# EAGLE design Rx1.0 (EAGLE 7.6.0)
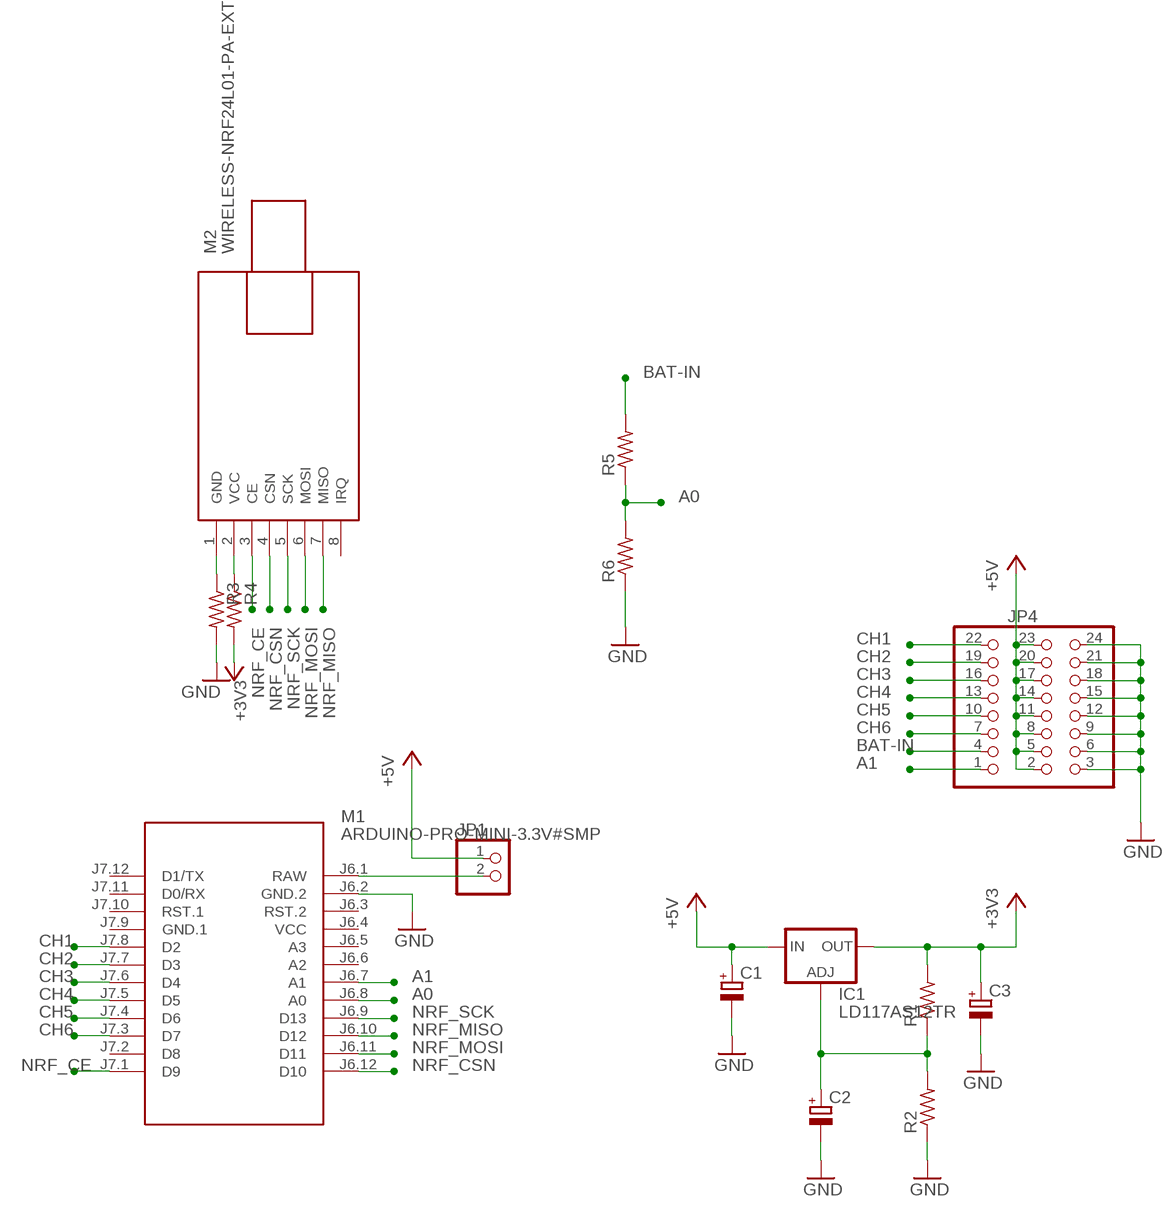
[diagram p0: schematic, sheet 1]

## Parts
C1  CPOL-EUE1.8-4  [E1,8-4]
C2  CPOL-EUE1.8-4  [E1,8-4]
C3  CPOL-EUE1.8-4  [E1,8-4]
IC1  LD117AS12TR  [SOT223]
JP1  PINHD-1X2  [1X02]
JP4  PINHD-3X8  [2X08]
M1  ARDUINO-PRO-MINI-3.3V#SMP  [ARDUINO-PRO-MINI#SMP]
M2  WIRELESS-NRF24L01-PA-EXT  [WIRELESS-NRF24L01-PA-EXT]
R1  R-US_0204/2V  [0204V]
R2  R-US_0204/2V  [0204V]
R3  R-US_0204/2V  [0204V]
R4  R-US_0204/2V  [0204V]
R5  R-US_0204/2V  [0204V]
R6  R-US_0204/2V  [0204V]

## Nets
+3V3: C3.+ IC1.4(OUT) R1.2 R4.2
+5V: C1.+ IC1.3(IN) JP1.1 JP4.2 JP4.5 JP4.8 JP4.11 JP4.14 JP4.17 JP4.20 JP4.23
A0: M1.J6.8(A0) R5.1 R6.2
A1: JP4.1 M1.J6.7(A1)
BAT-IN: JP4.4 R5.2
CH1: JP4.22 M1.J7.8(D2)
CH2: JP4.19 M1.J7.7(D3)
CH3: JP4.16 M1.J7.6(D4)
CH4: JP4.13 M1.J7.5(D5)
CH5: JP4.10 M1.J7.4(D6)
CH6: JP4.7 M1.J7.3(D7)
GND: C1.- C2.- C3.- JP4.3 JP4.6 JP4.9 JP4.12 JP4.15 JP4.18 JP4.21 JP4.24 M1.J6.2(GND.2) R2.1 R3.2 R6.1
N$1: M2.1(GND) R3.1
N$2: M2.2(VCC) R4.1
N$5: C2.+ IC1.1(ADJ) R1.1 R2.2
N$54: JP1.2 M1.J6.1(RAW)
NRF_CE: M1.J7.1(D9) M2.3(CE)
NRF_CSN: M1.J6.12(D10) M2.4(CSN)
NRF_MISO: M1.J6.10(D12) M2.7(MISO)
NRF_MOSI: M1.J6.11(D11) M2.6(MOSI)
NRF_SCK: M1.J6.9(D13) M2.5(SCK)
Unconnected: M1.J6.3(RST.2) M1.J6.5(A3) M1.J6.6(A2) M1.J7.2(D8) M1.J7.10(RST.1) M1.J7.11(D0/RX) M1.J7.12(D1/TX) M2.8(IRQ)

## Power pins joined to a net without a drawn wire
GND.1: M1.J7.9(GND.1)
VCC: M1.J6.4(VCC)

## Library data of the parts
C1-C3 = rcl:CPOL-EU: POLARIZED CAPACITOR, European symbol
IC1 = v-reg:LD117A?*: Low drop fixed and adjustable positive voltage regulators 1 A Source: http://www.st.com/stonline/products/literature/ds/7194/ld1117axx.pdf
JP1 = pinhead:PINHD-1X2: PIN HEADER
JP4 = pinhead_2:PINHD-3X8: PIN HEADER
M1 = diy-modules:ARDUINO-PRO-MINI-*#SMP: Arduino Pro Mini (and compatible devices) with 2 connectors only More details available here: https://www.arduino.cc/en/Main/ArduinoBoardProMini Click here to find device on ebay.com <http://www.ebay.com/sch/arduino+pro+mini>
M2 = diy-modules:WIRELESS-NRF24L01-PA-EXT: 2.4 GHz Wireless Module based on NRF24L01 chip with preamplifier and external antenna Click here to find device on ebay.com <http://www.ebay.com/sch/nrf24l01+pa+lna+sma>
R1-R6 = rcl:R-US_: RESISTOR, American symbol

## Board
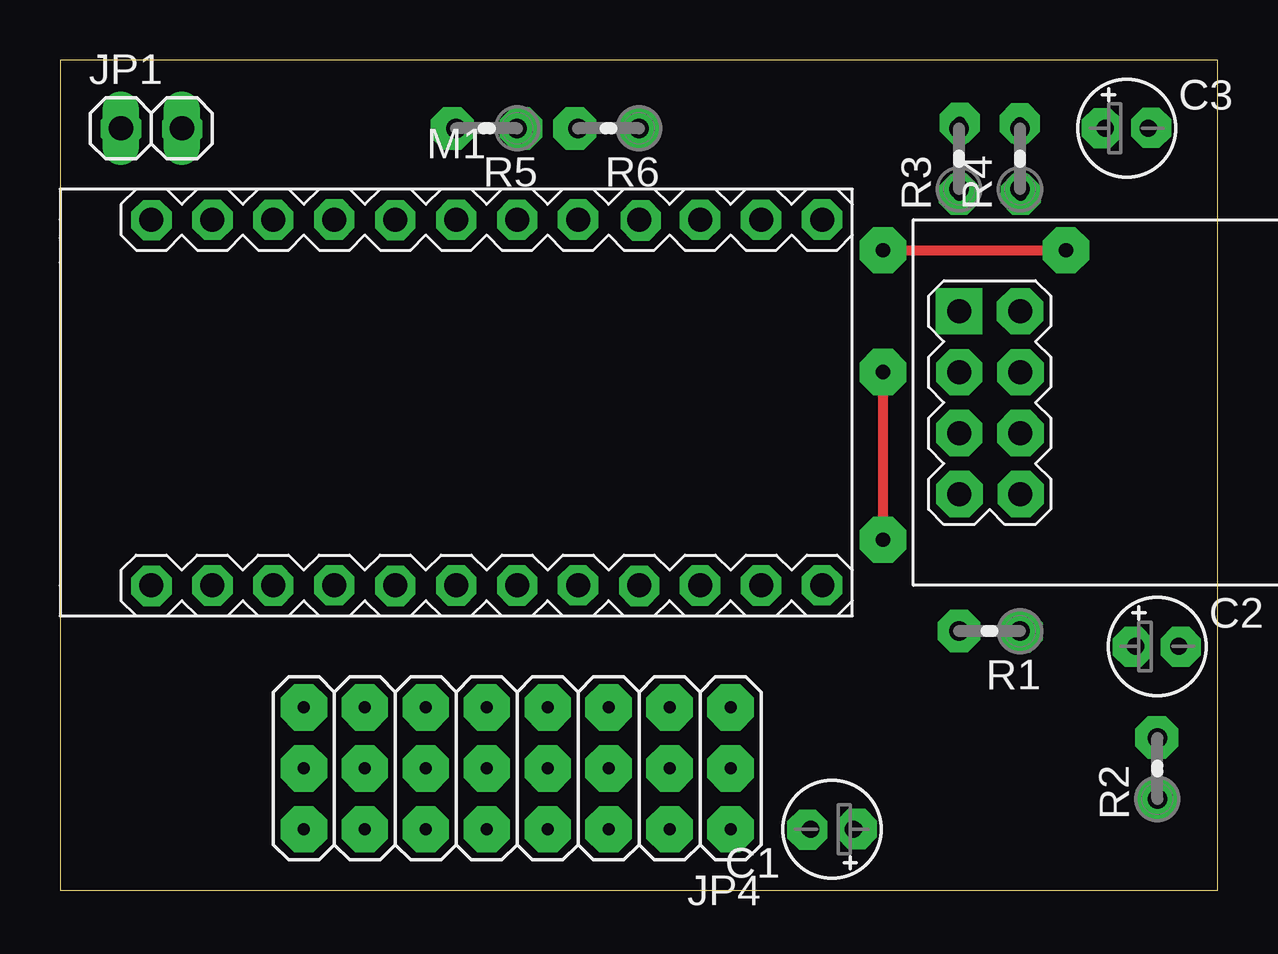
[diagram p1: board, top side]
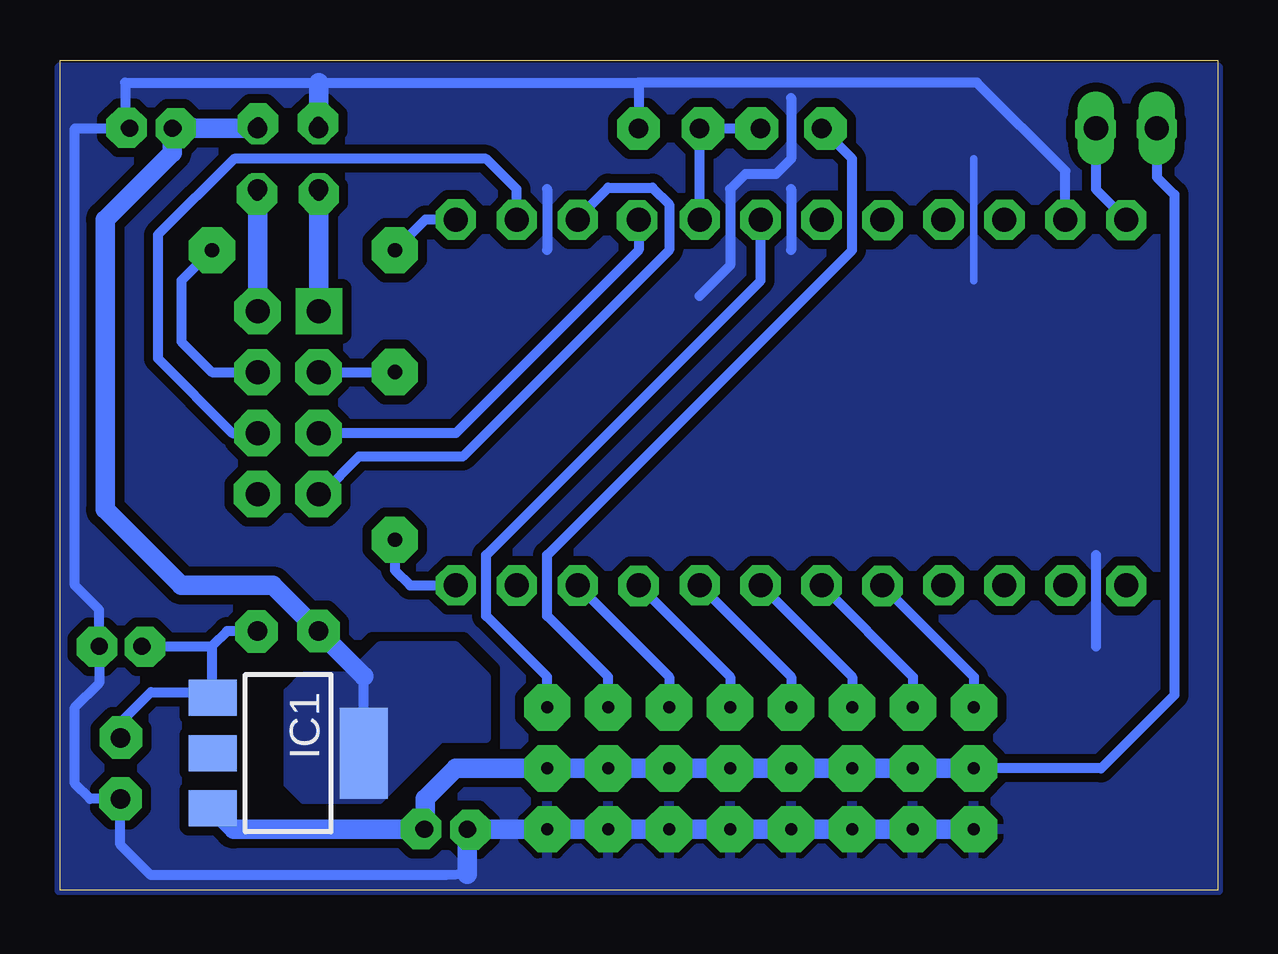
[diagram p2: board, bottom side, seen from below]

Size 48.24 x 34.59 mm. Coordinates in mm from the lower left corner, seen from the top.
Outline: 0,0 48.24,0 48.24,34.59 0,34.59 0,0
Copper layers (1*16): Top 0.035mm / dielectric 1.5mm / Bottom 0.035mm
Design rules "default *": minimum track width 10mil, minimum drill 24mil, track to track 8mil, track to pad 8mil, pad to pad 8mil, via to via 8mil, smd to smd 8mil, copper to edge 0mil, drill to drill 8mil, minimum pad ring 10mil, minimum via ring 8mil, stop-mask expansion 4mil, vias tented up to drill 0mil, thermal gap 10mil

### Footprints (pad centres in the part's own frame; a part is rotated, then mirrored left to right if it is on the bottom)
E1,8-4 = drill 0.711 pad 1.168: + -0.889,0 | drill 0.711 pad 1.168 octagon: - 0.889,0
SOT223 = smd 1.5 x 2: 1 -2.3,-3.15; 2 0,-3.15; 3 2.3,-3.15 | smd 3.8 x 2: 4 0,3.15
1X02 = drill 1.016 long: 1 -1.27,0; 2 1.27,0
2X08 = drill 0.5 pad 1.93 octagon: 1 -8.89,-1.27; 2 -8.89,1.27; 3 -8.89,3.81; 4 -6.35,-1.27; 5 -6.35,1.27; 6 -6.35,3.81; 7 -3.81,-1.27; 8 -3.81,1.27; 9 -3.81,3.81; 10 -1.27,-1.27; 11 -1.27,1.27; 12 -1.27,3.81; 13 1.27,-1.27; 14 1.27,1.27; 15 1.27,3.81; 16 3.81,-1.27; 17 3.81,1.27; 18 3.81,3.81; 19 6.35,-1.27; 20 6.35,1.27; 21 6.35,3.81; 22 8.89,-1.27; 23 8.89,1.27; 24 8.89,3.81
ARDUINO-PRO-MINI#SMP = drill 1: J6.1 -12.7,7.62; J6.2 -10.16,7.62; J6.3 -7.62,7.62; J6.4 -5.08,7.62; J6.5 -2.54,7.62; J6.6 0,7.62; J6.7 2.54,7.62; J6.8 5.08,7.62; J6.9 7.62,7.62; J6.10 10.16,7.62; J6.11 12.7,7.62; J6.12 15.24,7.62; J7.1 15.24,-7.62; J7.2 12.7,-7.62; J7.3 10.16,-7.62; J7.4 7.62,-7.62; J7.5 5.08,-7.62; J7.6 2.54,-7.62; J7.7 0,-7.62; J7.8 -2.54,-7.62; J7.9 -5.08,-7.62; J7.10 -7.62,-7.62; J7.11 -10.16,-7.62; J7.12 -12.7,-7.62
WIRELESS-NRF24L01-PA-EXT = drill 1 square: 1 -18.415,3.81 | drill 1: 2 -15.875,3.81; 3 -18.415,1.27; 4 -15.875,1.27; 5 -18.415,-1.27; 6 -15.875,-1.27; 7 -18.415,-3.81; 8 -15.875,-3.81
0204V = drill 0.813 octagon: 1 -1.27,0; 2 1.27,0

### Placement (x,y rotation side)
C1  32.16,2.54 180 top
C2  45.72,10.16 0 top
C3  44.45,31.75 0 top
IC1  38.73,5.71 270 bottom
JP1  3.81,31.75 0 top
JP4  19.05,6.35 180 top
M1  16.51,20.32 0 top
M2  55.88,20.32 0 top
R1  38.73,10.79 180 top
R2  45.72,5.08 90 top
R3  37.47,30.48 90 top
R4  40,30.48 90 top
R5  17.78,31.75 180 top
R6  22.86,31.75 180 top

### Tracks (layer width: path | path; a pad name or v marks a point on that pad's centre or on a via)
+3V3
  Bottom 0.406: C3.+ 43.56,32 | IC1.4 35.58,8.91
  Bottom 0.813: 43.56,32 42.55,31.75 R4.2 | 35.58,8.91 R1.2 39.37,12.7 43.18,12.7 46.36,15.88 46.36,27.94 43.56,30.73 C3.+
  pour Bottom (isolate 0.254, no thermals): 34.92,3.81 32.39,6.35 30.48,6.35 30.48,8.89 31.75,10.16 34.92,10.16 36.19,8.89 38.1,8.89 38.73,8.25 38.73,4.45 38.1,3.81
+5V
  Bottom 0.406: JP4.23 4.86,5.08 1.81,8.13 1.81,28.99 2.54,29.72 JP1.1
  Bottom 0.813: JP4.23 JP4.20 JP4.17 JP4.14 JP4.11 JP4.8 JP4.5 JP4.2 31.75,5.08 33.02,3.81 33.02,2.57 C1.+ 41.01,2.54 IC1.3
A0
  Bottom 0.406: M1.J6.8 R6.2 R5.1
A1
  Bottom 0.406: JP4.1 27.94,8.89 30.48,11.43 30.48,13.97 19.05,25.4 M1.J6.7
BAT-IN
  Bottom 0.406: JP4.4 25.4,8.89 27.94,11.43 27.94,13.97 15.24,26.67 15.24,30.48 R5.2
CH1
  Bottom 0.406: M1.J7.8 10.16,8.89 JP4.22
CH2
  Bottom 0.406: M1.J7.7 12.7,8.89 JP4.19
CH3
  Bottom 0.406: M1.J7.6 15.24,8.89 JP4.16
CH4
  Bottom 0.406: M1.J7.5 17.78,8.89 JP4.13
CH5
  Bottom 0.406: M1.J7.4 20.32,8.89 JP4.10
CH6
  Bottom 0.406: M1.J7.3 22.86,8.89 JP4.7
GND
  Bottom 0.305: 10.16,25.4 10.16,30.48
  Bottom 0.406: 45.34,32.13 C3.- 45.72,31.75 | 24.13,33.66 37.47,33.66 45.53,33.66 45.53,31.85 45.72,31.85 45.72,31.75 | 24.13,33.66 R6.1 | M1.J6.2 6.35,29.97 10.03,33.66 24.13,33.66 | JP4.6 26.67,2.54 | 31.27,0.67 32.16,0.63 44.45,0.63 45.72,1.9 R2.1 46.99,3.81 47.62,4.45 47.62,7.62 46.61,8.64 C2.- 46.61,11.68 47.62,12.7 47.62,31.75 45.72,31.75 | 17.78,33.02 17.78,30.48 18.42,29.85 19.68,29.85 20.32,29.21 20.32,26.04 21.59,24.76 | 17.78,29.21 17.78,26.67 | 27.94,29.21 27.94,26.67 | 5.08,13.97 5.08,10.16
  Bottom 0.813: R3.2 37.47,33.66 | JP4.24 JP4.21 JP4.18 JP4.15 JP4.12 JP4.9 JP4.6 JP4.3 C1.- 31.27,0.67
  pour Bottom (isolate 0.381, rank 2): 0,0 48.26,0 48.26,34.29 0,34.29
N$1
  Bottom 0.813: R3.1 M2.1
N$2
  Bottom 0.813: R4.1 M2.2
N$3  (via drill 0.5 pad 1.68)
  other vias: 3.81,12.68
N$4  (via drill 0.5 pad 1.68)
  other vias: 6.35,12.69
N$5
  Bottom 0.406: R1.1 41.28,10.79 41.91,10.16 | 41.91,10.16 41.91,8.04 IC1.1 42.12,8.25 44.45,8.25 45.72,6.98 R2.2 | C2.+ 41.91,10.16
N$6  (via drill 0.5 pad 1.68)
  other vias: 8.89,12.69
N$7  (via drill 0.5 pad 1.68)
  other vias: 11.43,12.71
N$8  (via drill 0.5 pad 1.68)
  other vias: 13.97,12.68
N$9  (via drill 0.5 pad 1.68)
  other vias: 16.51,12.69
N$10  (via drill 0.5 pad 1.68)
  other vias: 19.05,12.69
N$11  (via drill 0.5 pad 1.68)
  other vias: 21.59,12.71
N$12  (via drill 0.5 pad 1.68)
  other vias: 24.13,12.68
N$13  (via drill 0.5 pad 1.68)
  other vias: 26.67,12.69
N$14  (via drill 0.5 pad 1.68)
  other vias: 29.21,12.69
N$15  (via drill 0.5 pad 1.68)
  other vias: 31.75,12.71
N$16  (via drill 0.5 pad 1.68)
  other vias: 3.81,27.92
N$17  (via drill 0.5 pad 1.68)
  other vias: 6.35,27.93
N$18  (via drill 0.5 pad 1.68)
  other vias: 8.89,27.93
N$19  (via drill 0.5 pad 1.68)
  other vias: 11.43,27.95
N$20  (via drill 0.5 pad 1.68)
  other vias: 13.97,27.92
N$21  (via drill 0.5 pad 1.68)
  other vias: 16.51,27.93
N$22  (via drill 0.5 pad 1.68)
  other vias: 19.05,27.93
N$23  (via drill 0.5 pad 1.68)
  other vias: 21.59,27.95
N$24  (via drill 0.5 pad 1.68)
  other vias: 24.2,27.9
N$25  (via drill 0.5 pad 1.68)
  other vias: 26.67,27.93
N$26  (via drill 0.5 pad 1.68)
  other vias: 29.21,27.93
N$27  (via drill 0.5 pad 1.68)
  other vias: 31.75,27.95
N$28  (via drill 0.5 pad 1.93)
  other vias: 40.03,16.51
N$29  (via drill 0.5 pad 1.93)
  other vias: 40.02,19.05
N$30  (via drill 0.5 pad 1.93)
  other vias: 40.02,21.59
N$31  (via drill 0.5 pad 1.93)
  other vias: 40.01,24.12
N$32  (via drill 0.5 pad 1.93)
  other vias: 37.48,16.51
N$33  (via drill 0.5 pad 1.93)
  other vias: 37.47,19.05
N$34  (via drill 0.5 pad 1.93)
  other vias: 37.47,21.59
N$35  (via drill 0.5 pad 1.93)
  other vias: 37.45,24.13
N$36  (via drill 0.5 pad 1.78)
  other vias: 16.34,31.73
N$37  (via drill 0.5 pad 1.78)
  other vias: 19.21,31.75
N$38  (via drill 0.5 pad 1.78)
  other vias: 21.45,31.73
N$39  (via drill 0.5 pad 1.78)
  other vias: 24.14,31.73
N$40  (via drill 0.5 pad 1.68)
  other vias: 37.46,28.99
N$41  (via drill 0.5 pad 1.68)
  other vias: 40.03,28.99
N$42  (via drill 0.5 pad 1.68)
  other vias: 39.99,31.95
N$43  (via drill 0.5 pad 1.68)
  other vias: 37.49,31.98
N$44  (via drill 0.5 pad 1.68)
  other vias: 45.46,31.77
N$45  (via drill 0.5 pad 1.68)
  other vias: 43.42,31.76
N$46  (via drill 0.5 pad 1.68)
  other vias: 31.14,2.52
N$47  (via drill 0.5 pad 1.68)
  other vias: 33.2,2.55
N$48  (via drill 0.5 pad 1.78)
  other vias: 37.46,10.8
N$49  (via drill 0.5 pad 1.78)
  other vias: 40.05,10.78
N$50  (via drill 0.5 pad 1.68)
  other vias: 46.7,10.14
N$51  (via drill 0.5 pad 1.68)
  other vias: 44.7,10.14
N$52  (via drill 0.5 pad 1.78)
  other vias: 45.7,6.36
N$53  (via drill 0.5 pad 1.78)
  other vias: 45.72,3.82
N$54
  Bottom 0.406: JP1.2 5.08,29.21 M1.J6.1
N$55  (via drill 0.5 pad 1.68)
  other vias: 2.54,31.73
N$56  (via drill 0.5 pad 1.68)
  other vias: 5.1,31.72
NRF_CE  (via drill 0.6 pad 1.93)
  Top 0.406: v34.29,21.59 v34.29,14.61
  Bottom 0.406: M2.3 v34.29,21.59 | v34.29,14.61 34.29,13.34 33.66,12.7 M1.J7.1
NRF_CSN  (via drill 0.6 pad 1.93)
  Top 0.406: v34.29,26.67 v41.91,26.67
  Bottom 0.406: M1.J6.12 33.02,27.94 v34.29,26.67 | v41.91,26.67 43.18,25.4 43.18,22.86 41.91,21.59 M2.4
NRF_MISO
  Bottom 0.406: M1.J6.10 26.67,28 25.4,29.27 23.56,29.27 22.86,28.57 22.86,26.67 31.46,18.07 35.78,18.07 37.34,16.51 M2.7
NRF_MOSI
  Bottom 0.406: M1.J6.11 29.21,29.21 30.48,30.48 40.99,30.48 44.16,27.31 44.16,22.16 41.05,19.05 M2.6
NRF_SCK
  Bottom 0.406: M1.J6.9 24.13,26.67 31.75,19.05 M2.5